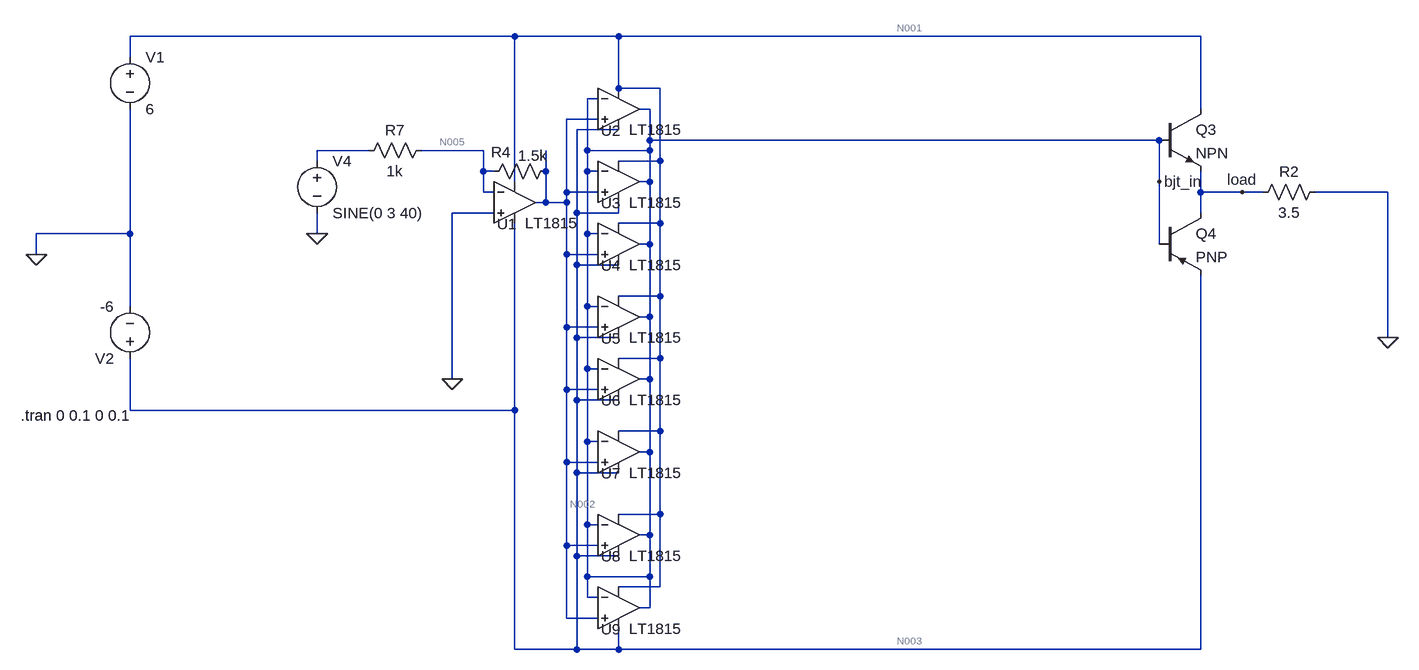
[diagram p0: schematic PowerAmp.asc]
* PowerAmp.asc
* U1: LT1815 (symbol Opamps\LT1815 not available, pins judged from their places): In+=0 In-=N005 V+=N001 V-=N003 OUT=N002
Q3 N001 bjt_in load 0 NPN
Q4 load bjt_in N003 0 PNP
R2 0 load 3.5
R4 N002 N005 1.5k
R7 N005 N004 1k
V1 N001 0 6
V2 N003 0 -6
V4 N004 0 SINE(0 3 40)
* U2: LT1815 (symbol Opamps\LT1815 not available, pins judged from their places): In+=N002 In-=bjt_in V+=N001 V-=N003 OUT=bjt_in
* U3: LT1815 (symbol Opamps\LT1815 not available, pins judged from their places): In+=N002 In-=bjt_in V+=N001 V-=N003 OUT=bjt_in
* U4: LT1815 (symbol Opamps\LT1815 not available, pins judged from their places): In+=N002 In-=bjt_in V+=N001 V-=N003 OUT=bjt_in
* U5: LT1815 (symbol Opamps\LT1815 not available, pins judged from their places): In+=N002 In-=bjt_in V+=N001 V-=N003 OUT=bjt_in
* U6: LT1815 (symbol Opamps\LT1815 not available, pins judged from their places): In+=N002 In-=bjt_in V+=N001 V-=N003 OUT=bjt_in
* U7: LT1815 (symbol Opamps\LT1815 not available, pins judged from their places): In+=N002 In-=bjt_in V+=N001 V-=N003 OUT=bjt_in
* U8: LT1815 (symbol Opamps\LT1815 not available, pins judged from their places): In+=N002 In-=bjt_in V+=N001 V-=N003 OUT=bjt_in
* U9: LT1815 (symbol Opamps\LT1815 not available, pins judged from their places): In+=N002 In-=bjt_in V+=N001 V-=N003 OUT=bjt_in
.model NPN NPN
.model PNP PNP
.lib standard.bjt
.tran 0 0.1 0 0.1
.backanno
.end

* Results of the author's LTspice run, read from the files saved beside the schematic
* Operating Point, zero values left out:
*   V(n005) = 3.628 µV
*   V(n001) = 6 V
*   V(n002) = -3.89 mV
*   V(n003) = -6 V
*   V(bjt_in) = -3.886 mV
*   Ib(Q4) = 5.992 pA
*   Ie(Q4) = -5.996 pA
*   Ic(Q3) = 6.004 pA
*   Ib(Q3) = -6.008 pA
*   I(R7) = 3.628 nA
*   I(R4) = -2.596 µA
*   I(V4) = 3.628 nA
*   I(V2) = 59.2 mA
*   I(V1) = -59.21 mA
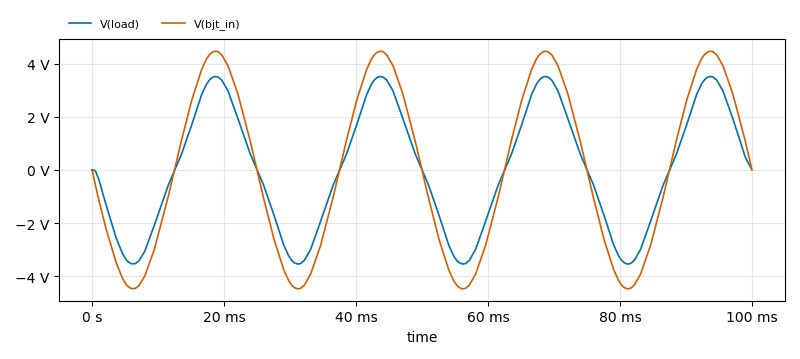
[diagram p1: Transient Analysis of PowerAmp.asc, plotted from the saved traces]
* Transient Analysis, 1 run:
*   V(load): min -3.547 V, max 3.522 V, average -8.938 mV, rms 2.354 V, last 0 V
*   V(bjt_in): min -4.482 V, max 4.475 V, average -4.132 mV, rms 3.15 V, last -3.884 mV